# EAGLE schematic mcp9808_breakout (EAGLE 7.4.0)
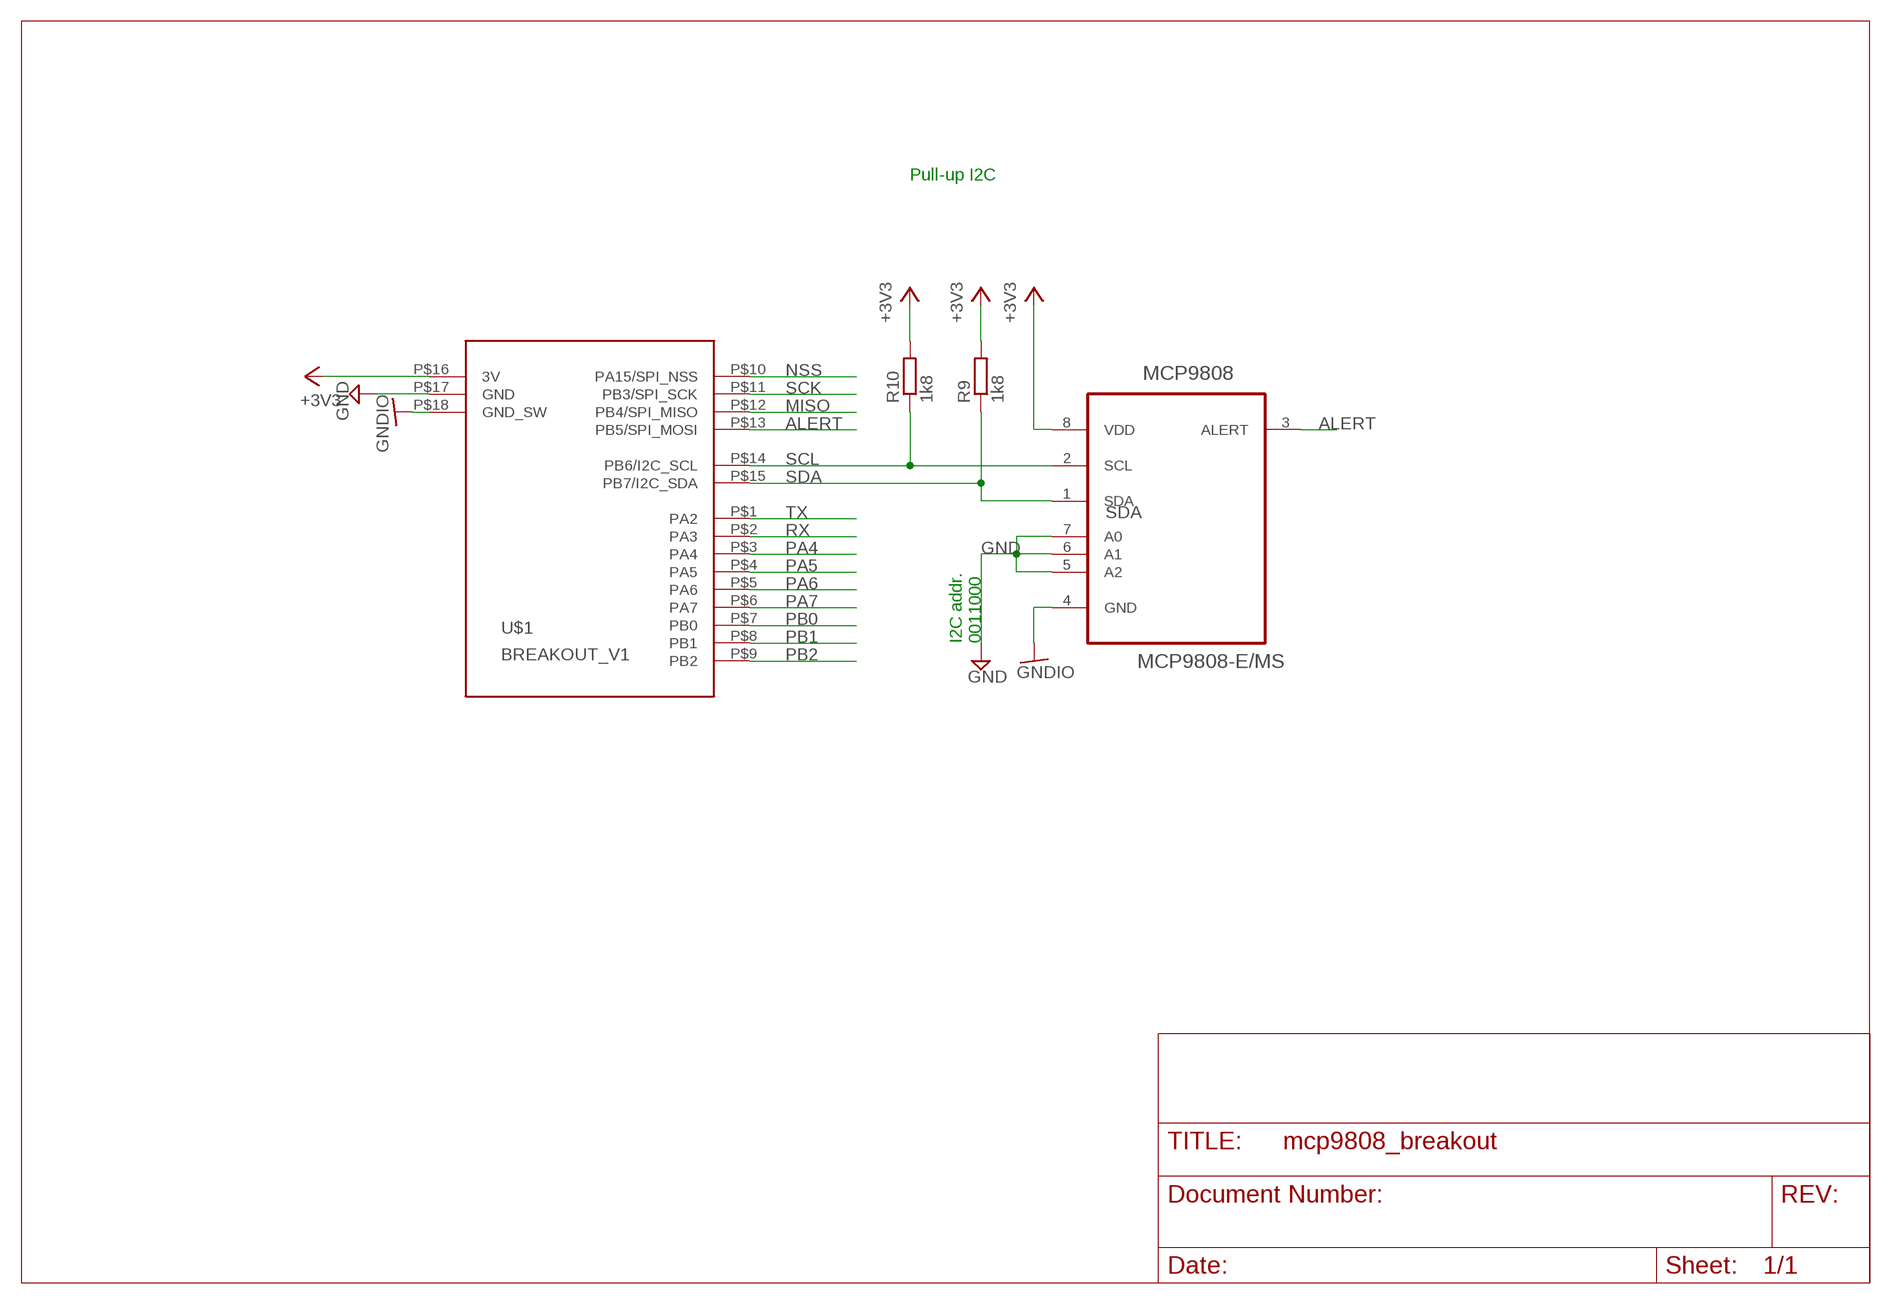
[diagram p0: schematic, sheet 1]

## Parts
MCP9808  MCP9808-E/MS  [SOP65P490X110-8N]
R9  1k8  R-EU_R0805  [R0805]
R10  1k8  R-EU_R0805  [R0805]
U$1  BREAKOUT_V1  [BREAKOUT_V1]

## Nets
+3V3: MCP9808.8(VDD) R9.2 R10.2 U$1.P$16(3V)
ALERT: MCP9808.3(ALERT) U$1.P$13(PB5/SPI_MOSI)
GND: MCP9808.5(A2) MCP9808.6(A1) MCP9808.7(A0) U$1.P$17(GND)
GNDIO: MCP9808.4(GND) U$1.P$18(GND_SW)
MISO: U$1.P$12(PB4/SPI_MISO)
NSS: U$1.P$10(PA15/SPI_NSS)
PA4: U$1.P$3(PA4)
PA5: U$1.P$4(PA5)
PA6: U$1.P$5(PA6)
PA7: U$1.P$6(PA7)
PB0: U$1.P$7(PB0)
PB1: U$1.P$8(PB1)
PB2: U$1.P$9(PB2)
RX: U$1.P$2(PA3)
SCK: U$1.P$11(PB3/SPI_SCK)
SCL: MCP9808.2(SCL) R10.1 U$1.P$14(PB6/I2C_SCL)
SDA: MCP9808.1(SDA) R9.1 U$1.P$15(PB7/I2C_SDA)
TX: U$1.P$1(PA2)

## Notes on the sheet
- Pull-up I2C
- I2C addr. 
  0011000

## Library data of the parts
MCP9808 = mcp9808:MCP9808-E/MS: Digital Temperature Sensor,MSOP-8; MPN: MCP9808-E/MS; OC_FARNELL: 2080523; OC_NEWARK: 89T8871; PACKAGE: MSOP-8; SUPPLIER: MICROCHIP
R9 R10 = rcl:R-EU_: RESISTOR, European symbol
U$1 = breakout_base:BREAKOUT_V1